# EAGLE design Enclosure 85x58 WS (EAGLE 9.6.2)
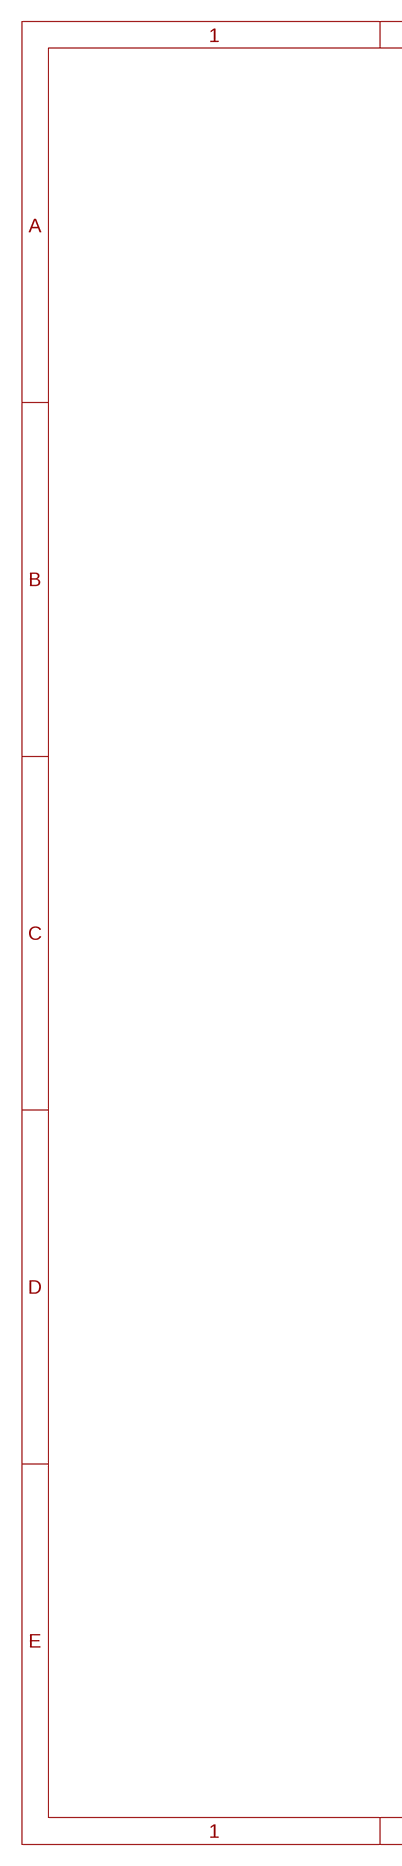
[diagram p0: schematic, sheet 1, part 1 of 2]
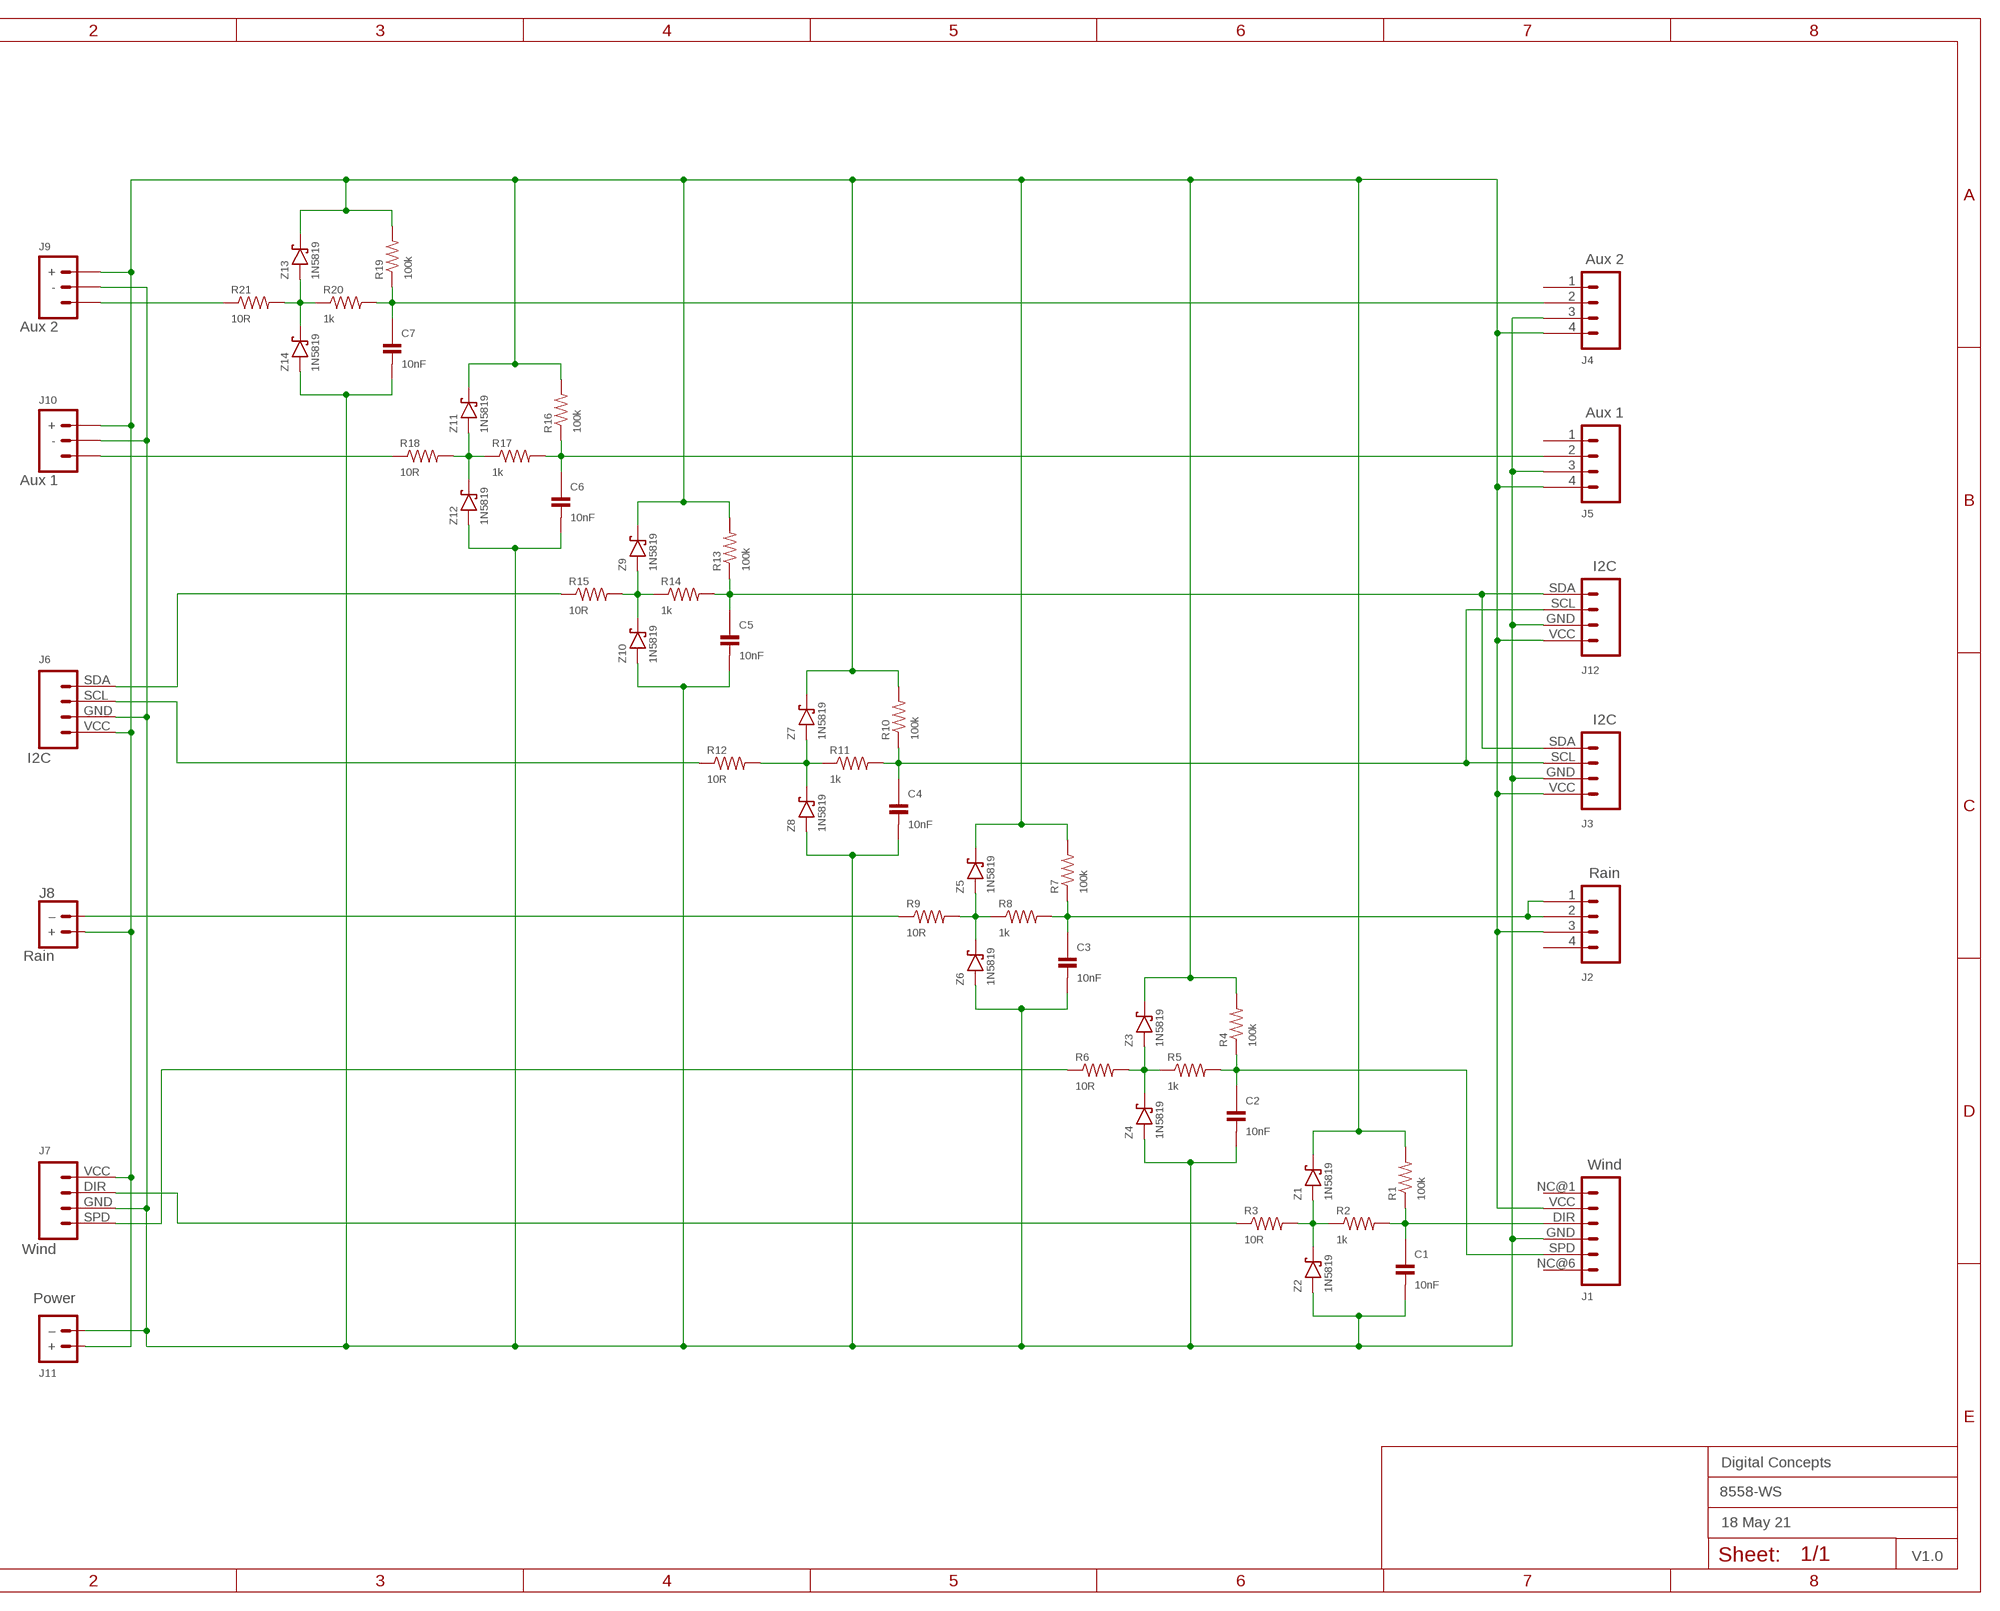
[diagram p1: schematic, sheet 1, part 2 of 2]
FRAME2 (A3L-LOC): DATE: 18 May 21; OWNER: Digital Concepts; TITLE: 8558-WS; VERSION: V1.0

## Parts
C1  10nF  CAPACITOR-0805-VIA-2  [C0805-VIA-2]
C2  10nF  CAPACITOR-0805-VIA-2  [C0805-VIA-2]
C3  10nF  CAPACITOR-0805-VIA-2  [C0805-VIA-2]
C4  10nF  CAPACITOR-0805-VIA-2  [C0805-VIA-2]
C5  10nF  CAPACITOR-0805-VIA-2  [C0805-VIA-2]
C6  10nF  CAPACITOR-0805-VIA-2  [C0805-VIA-2]
C7  10nF  CAPACITOR-0805-VIA-2  [C0805-VIA-2]
J1  Wind  RJ11-6P6C-VERTICAL-WIND  [RJ11-6-VERTICAL-WIND]
J2  Rain  RJ11-6P4C-VERTICAL  [RJ11-4-VERTICAL]
J3  I2C  RJ11-6P4C-VERTICAL-I2C  [RJ11-4-VERTICAL-I2C]
J4  Aux 2  RJ11-6P4C-VERTICAL  [RJ11-4-VERTICAL]
J5  Aux 1  RJ11-6P4C-VERTICAL  [RJ11-4-VERTICAL]
J6  I2C  JST-PH2.0-4-MALE-VERTICAL-I2C  [JST-PH2.0-4-VERTICAL-I2C]
J7  Wind  JST-PH2.0-4-MALE-VERTICAL-WIND  [JST-PH2.0-4-VERTICAL-WIND]
J8  Rain  JST-PH2.0-2-MALE-VERTICAL  [JST-PH2.0-2-VERTICAL=POWER]
J9  Aux 2  JST-PH2.0-3-MALE-VERTICAL  [JST-PH2.0-3-VERTICAL]
J10  Aux 1  JST-PH2.0-3-MALE-VERTICAL  [JST-PH2.0-3-VERTICAL]
J11  Power  JST-PH2.0-2-MALE-VERTICAL  [JST-PH2.0-2-VERTICAL=POWER]
J12  I2C  HEADER-1X4-I2C  [CONN_04-I2C]
R1  100k  RESISTORR0805  [R0805]
R2  1k  RESISTORR0805  [R0805]
R3  10R  RESISTOR-VIA-1  [R0805-VIA-1]
R4  100k  RESISTORR0805  [R0805]
R5  1k  RESISTORR0805  [R0805]
R6  10R  RESISTOR-VIA-1  [R0805-VIA-1]
R7  100k  RESISTORR0805  [R0805]
R8  1k  RESISTORR0805  [R0805]
R9  10R  RESISTOR-VIA-1  [R0805-VIA-1]
R10  100k  RESISTORR0805  [R0805]
R11  1k  RESISTORR0805  [R0805]
R12  10R  RESISTOR-VIA-1  [R0805-VIA-1]
R13  100k  RESISTORR0805  [R0805]
R14  1k  RESISTORR0805  [R0805]
R15  10R  RESISTOR-VIA-1  [R0805-VIA-1]
R16  100k  RESISTORR0805  [R0805]
R17  1k  RESISTORR0805  [R0805]
R18  10R  RESISTOR-VIA-1  [R0805-VIA-1]
R19  100k  RESISTORR0805  [R0805]
R20  1k  RESISTORR0805  [R0805]
R21  10R  RESISTOR-VIA-1  [R0805-VIA-1]
Z1  1N5819  DIODE-SCHOTTKY-1N5819  [SOD-123]
Z2  1N5819  DIODE-SCHOTTKY-1N5819-VIA-A  [SOD-123-VIA-A]
Z3  1N5819  DIODE-SCHOTTKY-1N5819  [SOD-123]
Z4  1N5819  DIODE-SCHOTTKY-1N5819-VIA-A  [SOD-123-VIA-A]
Z5  1N5819  DIODE-SCHOTTKY-1N5819  [SOD-123]
Z6  1N5819  DIODE-SCHOTTKY-1N5819-VIA-A  [SOD-123-VIA-A]
Z7  1N5819  DIODE-SCHOTTKY-1N5819  [SOD-123]
Z8  1N5819  DIODE-SCHOTTKY-1N5819-VIA-A  [SOD-123-VIA-A]
Z9  1N5819  DIODE-SCHOTTKY-1N5819  [SOD-123]
Z10  1N5819  DIODE-SCHOTTKY-1N5819-VIA-A  [SOD-123-VIA-A]
Z11  1N5819  DIODE-SCHOTTKY-1N5819  [SOD-123]
Z12  1N5819  DIODE-SCHOTTKY-1N5819-VIA-A  [SOD-123-VIA-A]
Z13  1N5819  DIODE-SCHOTTKY-1N5819  [SOD-123]
Z14  1N5819  DIODE-SCHOTTKY-1N5819-VIA-A  [SOD-123-VIA-A]

## Nets
GND: C1.2 C1.2@VIA C2.2 C2.2@VIA C3.2 C3.2@VIA C4.2 C4.2@VIA C5.2 C5.2@VIA C6.2 C6.2@VIA C7.2 C7.2@VIA J1.GND J3.GND J4.3 J5.3 J6.GND J7.GND J9.- J10.- J11.-(–) J12.GND Z2.A Z2.P$A(A) Z4.A Z4.P$A(A) Z6.A Z6.P$A(A) Z8.A Z8.P$A(A) Z10.A Z10.P$A(A) Z12.A Z12.P$A(A) Z14.A Z14.P$A(A)
N$1: R14.1 R15.2 Z9.A Z10.C
N$2: C2.1 J1.SPD R4.1 R5.2
N$3: C5.1 J3.SDA J12.SDA R13.1 R14.2
N$4: J7.DIR R3.1 R3.1@VIA
N$5: R11.1 R12.2 Z7.A Z8.C
N$6: C4.1 J3.SCL J12.SCL R10.1 R11.2
N$7: R8.1 R9.2 Z5.A Z6.C
N$8: J6.SDA R15.1 R15.1@VIA
N$9: J10.SIG R18.1 R18.1@VIA
N$10: J7.SPD R6.1 R6.1@VIA
N$11: J6.SCL R12.1 R12.1@VIA
N$12: J9.SIG R21.1 R21.1@VIA
N$13: R2.1 R3.2 Z1.A Z2.C
N$15: R17.1 R18.2 Z11.A Z12.C
N$20: C6.1 J5.2 R16.1 R17.2
N$22: R20.1 R21.2 Z13.A Z14.C
N$23: C7.1 J4.2 R19.1 R20.2
N$25: C3.1 J2.1 J2.2 R7.1 R8.2
N$27: C1.1 J1.DIR R1.1 R2.2
N$29: R5.1 R6.2 Z3.A Z4.C
N$32: J8.-(–) R9.1 R9.1@VIA
VCC: J1.VCC J2.3 J3.VCC J4.4 J5.4 J6.VCC J7.VCC J8.+ J9.+ J10.+ J11.+ J12.VCC R1.2 R4.2 R7.2 R10.2 R13.2 R16.2 R19.2 Z1.C Z3.C Z5.C Z7.C Z9.C Z11.C Z13.C
Unconnected: J1.NC@1 J1.NC@6 J2.4 J4.1 J5.1

## Library data of the parts
C1-C7 = digitalconcepts:CAPACITOR-0805-VIA-2: 0805 Capacitor with via on Pad 2
J1 = digitalconcepts:RJ11-6P6C-VERTICAL-WIND: RJ11-6P6C-Vertical PCB Socket
J2 J4 J5 = digitalconcepts:RJ11-6P4C-VERTICAL: RJ11-6P4C-Vertical PCB Socket
J3 = digitalconcepts:RJ11-6P4C-VERTICAL-I2C: RJ11-6P4C-Vertical PCB Socket
J6 = digitalconcepts:JST-PH2.0-4-MALE-VERTICAL-I2C: PH2.0 4P PCB Connector I2C
J7 = digitalconcepts:JST-PH2.0-4-MALE-VERTICAL-WIND: PH2.0 4P PCB Connector Davis Anemometer
J8 J11 = digitalconcepts:JST-PH2.0-2-MALE-VERTICAL: PH2.0 2P PCB Connector
J9 J10 = digitalconcepts:JST-PH2.0-3-MALE-VERTICAL: PH2.0 3P PCB Connector
J12 = digitalconcepts:HEADER-1X4-I2C: I2C Interface 1x4 Pin Header for I2C Interface
R1 R2 R4 R5 R7 R8 R10 R11 R13 R14 R16 R17 R19 R20 = digitalconcepts:RESISTOR: Resistor; SPICEPREFIX: R
R3 R6 R9 R12 R15 R18 R21 = digitalconcepts:RESISTOR-VIA-1: Resistor with via on Pad 1
Z1 Z3 Z5 Z7 Z9 Z11 Z13 = digitalconcepts:DIODE-SCHOTTKY-1N5819: 1N5819 Schottky Diode SOD-123
Z2 Z4 Z6 Z8 Z10 Z12 Z14 = digitalconcepts:DIODE-SCHOTTKY-1N5819-VIA-A: 1N5819 Schottky Diode SOD-123 with Cathode Via

## Board
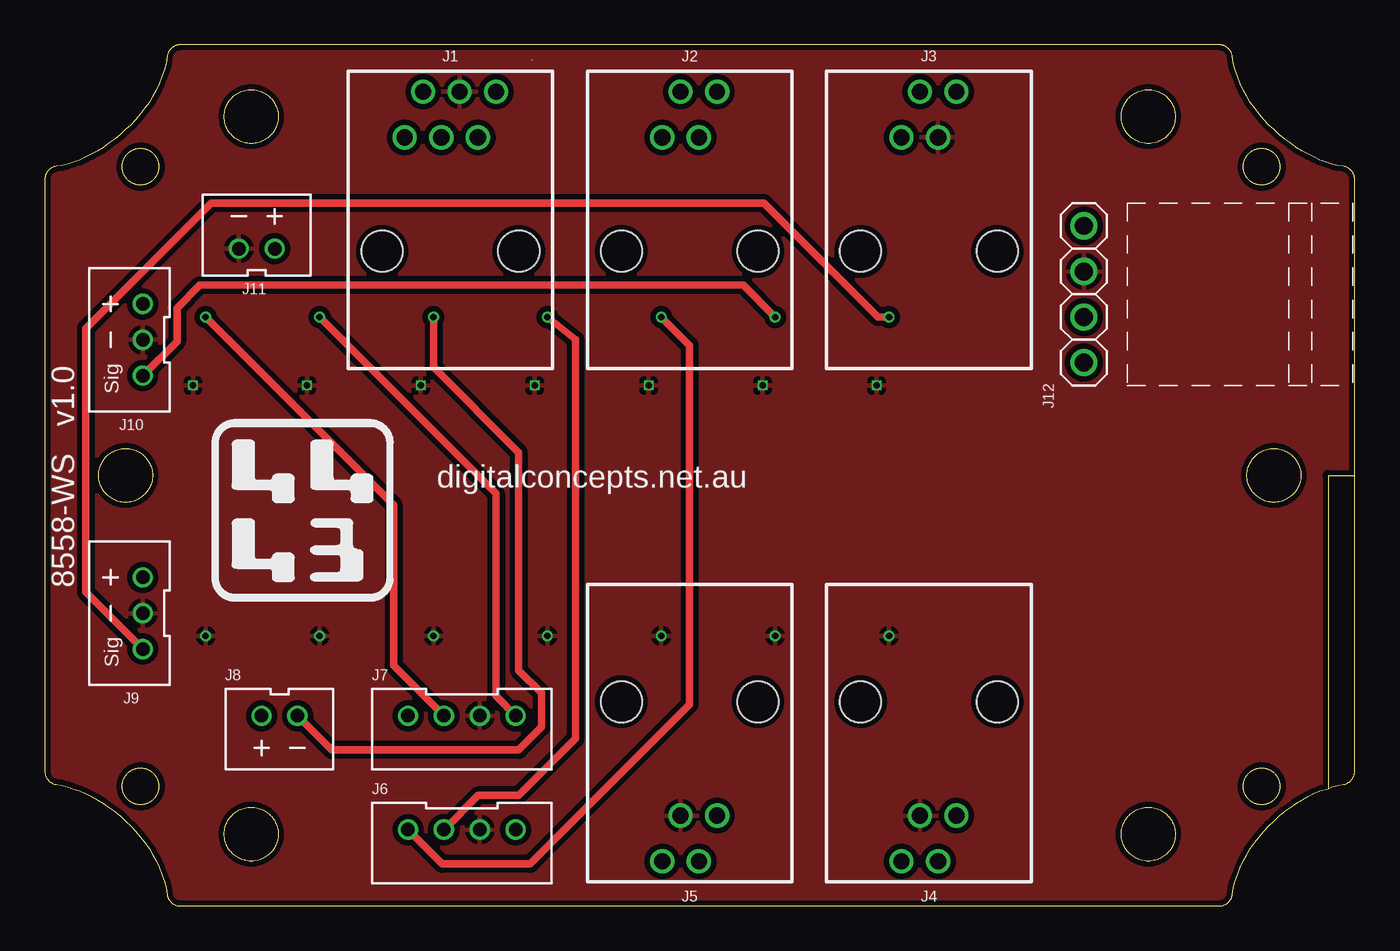
[diagram p2: board, top side]
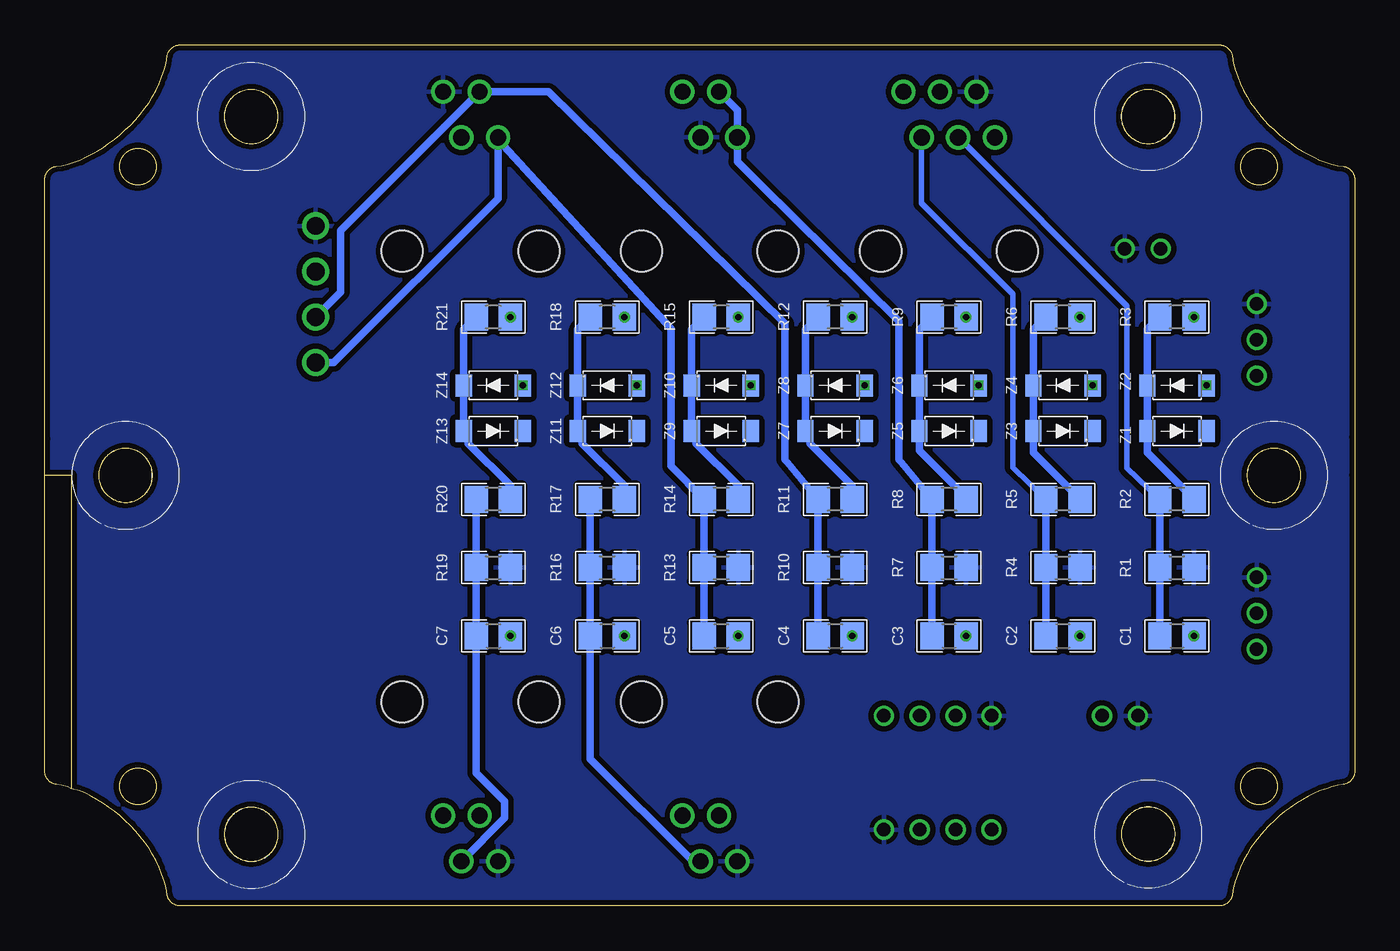
[diagram p3: board, bottom side, seen from below]

Size 73 x 48 mm. Coordinates in mm from the lower left corner, seen from the top.
Outline: 0,24 0,26.12 0,40.49 0,40.5 0,40.55 0,40.59 0.01,40.64 0.02,40.68 0.03,40.72 0.05,40.76 0.07,40.8 0.09,40.84 0.11,40.88 0.13,40.92 0.16,40.95 0.18,40.98 0.21,41.02 0.24,41.05 0.28,41.07 0.31,41.1 0.35,41.12 0.38,41.14 0.42,41.16 0.46,41.18 0.5,41.2 0.54,41.21 0.58,41.22 0.63,41.23 0.94,41.27 1.27,41.36 1.6,41.47 1.93,41.58 2.26,41.73 2.59,41.9 2.92,42.08 3.25,42.28 3.57,42.51 3.89,42.73 4.2,42.98 4.49,43.26 4.78,43.53 5.06,43.83 5.32,44.14 5.57,44.46 5.8,44.79 6.01,45.14 6.21,45.48 6.38,45.85 6.52,46.22 6.66,46.6 6.76,46.98 6.82,47.38 6.83,47.42 6.84,47.47 6.85,47.51 6.87,47.55 6.89,47.59 6.91,47.63 6.93,47.66 6.95,47.7 6.98,47.73 7.01,47.76 7.04,47.79 7.07,47.82 7.1,47.85 7.14,47.87 7.17,47.9 7.21,47.92 7.25,47.94 7.29,47.95 7.33,47.97 7.37,47.98 7.42,47.99 7.46,48 7.51,48 65.49,48 65.54,48 65.58,47.99 65.63,47.98 65.67,47.97 65.71,47.95 65.75,47.94 65.79,47.92 65.83,47.9 65.86,47.87 65.9,47.85 65.93,47.82 65.96,47.79 65.99,47.76 66.02,47.73 66.05,47.7 66.07,47.66 66.09,47.63 66.11,47.59 66.13,47.55 66.15,47.51 66.16,47.47 66.17,47.42 66.18,47.38 66.24,46.98 66.34,46.6 66.48,46.22 66.62,45.85 66.79,45.48 66.99,45.14 67.2,44.79 67.43,44.46 67.68,44.14 67.94,43.83 68.22,43.53 68.51,43.26 68.8,42.98 69.11,42.73 69.43,42.51 69.75,42.28 70.08,42.08 70.41,41.9 70.74,41.73 71.07,41.58 71.4,41.47 71.73,41.36 72.06,41.27 72.37,41.23 72.42,41.22 72.46,41.21 72.5,41.2 72.54,41.18 72.58,41.16 72.62,41.14 72.65,41.12 72.69,41.1 72.72,41.07 72.76,41.05 72.79,41.02 72.82,40.98 72.84,40.95 72.87,40.92 72.89,40.88 72.92,40.84 72.93,40.8 72.95,40.76 72.97,40.72 72.98,40.68 72.99,40.64 73,40.59 73,40.55 73,26.05 73,24
Outline: 0,24 0,7.45 0,7.41 0.01,7.36 0.02,7.32 0.03,7.28 0.05,7.24 0.07,7.19 0.09,7.16 0.11,7.12 0.13,7.08 0.16,7.05 0.18,7.02 0.21,6.98 0.24,6.95 0.28,6.93 0.31,6.9 0.35,6.88 0.38,6.86 0.42,6.84 0.46,6.82 0.5,6.8 0.54,6.79 0.58,6.78 0.63,6.77 0.94,6.72 1.27,6.64 1.47,6.57 1.93,6.41 2.26,6.27 2.59,6.1 2.92,5.92 3.25,5.72 3.57,5.49 3.89,5.27 4.2,5.01 4.49,4.74 4.78,4.47 5.06,4.17 5.32,3.86 5.57,3.54 5.8,3.21 6.01,2.86 6.21,2.52 6.38,2.15 6.52,1.78 6.66,1.4 6.76,1.02 6.82,0.62 6.83,0.58 6.84,0.53 6.85,0.49 6.87,0.45 6.89,0.41 6.91,0.37 6.93,0.34 6.95,0.3 6.98,0.27 7.01,0.24 7.04,0.21 7.07,0.18 7.1,0.15 7.14,0.13 7.17,0.1 7.21,0.08 7.25,0.06 7.29,0.05 7.33,0.03 7.37,0.02 7.42,0.01 7.46,0 7.51,0 65.49,0 65.54,0 65.58,0.01 65.62,0.02 65.67,0.03 65.71,0.05 65.75,0.06 65.79,0.08 65.82,0.1 65.86,0.13 65.9,0.15 65.93,0.18 65.96,0.21 65.99,0.24 66.02,0.27 66.05,0.3 66.07,0.34 66.09,0.37 66.11,0.41 66.13,0.45 66.14,0.49 66.16,0.53 66.17,0.58 66.18,0.62 66.24,1.02 66.34,1.4 66.48,1.78 66.62,2.15 66.79,2.52 66.99,2.86 67.2,3.21 67.43,3.54 67.68,3.86 67.94,4.17 68.22,4.47 68.51,4.74 68.8,5.01 69.11,5.27 69.43,5.49 69.75,5.72 70.08,5.92 70.41,6.1 70.74,6.27 71.07,6.41 71.53,6.53
Outline: 71.53,6.53 71.73,6.64 72.06,6.72 72.37,6.77 72.41,6.78 72.46,6.79 72.5,6.8 72.54,6.82 72.58,6.84 72.62,6.86 72.65,6.88 72.69,6.9 72.72,6.93 72.76,6.95 72.79,6.98 72.82,7.02 72.84,7.05 72.87,7.08 72.89,7.12 72.91,7.16 72.93,7.19 72.95,7.24 72.97,7.28 72.98,7.32 72.99,7.36 72.99,7.41 73,7.45 73,14.22 73,16.02 73,24
Outline: 0,24 0,24
Outline: 71.53,6.53 71.53,24 73,24
Outline: 5.97,23.7 5.95,23.6 5.92,23.51 5.88,23.42 5.84,23.33 5.8,23.24 5.74,23.16 5.69,23.08 5.63,23.01 5.56,22.94 5.49,22.87 5.42,22.81 5.34,22.76 5.26,22.7 5.17,22.66 5.08,22.62 4.99,22.58 4.9,22.55 4.8,22.53 4.7,22.51 4.6,22.5 4.4,22.5 4.3,22.51 4.2,22.53 4.1,22.55 4.01,22.58 3.92,22.62 3.83,22.66 3.74,22.7 3.66,22.76 3.58,22.81 3.51,22.87 3.44,22.94 3.37,23.01 3.31,23.08 3.26,23.16 3.2,23.24 3.16,23.33 3.12,23.42 3.08,23.51 3.05,23.6 3.03,23.7 3.01,23.8 3,23.9 3,24.1 3.01,24.2 3.03,24.3 3.05,24.4 3.08,24.49 3.12,24.58 3.16,24.67 3.2,24.76 3.26,24.84 3.31,24.92 3.37,24.99 3.51,25.13 3.58,25.19 3.66,25.24 3.74,25.3 3.83,25.34 3.92,25.38 4.01,25.42 4.1,25.45 4.2,25.47 4.3,25.49 4.4,25.5 4.6,25.5 4.7,25.49 4.8,25.47 4.9,25.45 4.99,25.42 5.08,25.38 5.17,25.34 5.26,25.3 5.34,25.24 5.42,25.19 5.49,25.13 5.63,24.99 5.69,24.92 5.74,24.84 5.8,24.76 5.84,24.67 5.88,24.58 5.92,24.49 5.95,24.4 5.97,24.3 5.99,24.2 6,24.1 6,23.9 5.99,23.8 5.97,23.7
Outline: 12.97,3.7 12.95,3.6 12.92,3.51 12.88,3.42 12.84,3.33 12.8,3.24 12.74,3.16 12.69,3.08 12.63,3.01 12.56,2.94 12.49,2.87 12.42,2.81 12.26,2.7 12.17,2.66 12.08,2.62 11.99,2.58 11.9,2.55 11.7,2.51 11.6,2.5 11.4,2.5 11.3,2.51 11.2,2.53 11.1,2.55 11.01,2.58 10.92,2.62 10.83,2.66 10.74,2.7 10.58,2.81 10.51,2.87 10.44,2.94 10.37,3.01 10.31,3.08 10.26,3.16 10.2,3.24 10.16,3.33 10.12,3.42 10.08,3.51 10.05,3.6 10.03,3.7 10.01,3.8 10,3.9 10,4.1 10.01,4.2 10.03,4.3 10.05,4.4 10.08,4.49 10.12,4.58 10.16,4.67 10.2,4.76 10.26,4.84 10.31,4.92 10.37,4.99 10.44,5.06 10.51,5.13 10.58,5.19 10.74,5.3 10.83,5.34 10.92,5.38 11.01,5.42 11.1,5.45 11.2,5.47 11.3,5.49 11.4,5.5 11.6,5.5 11.7,5.49 11.8,5.47 11.9,5.45 11.99,5.42 12.08,5.38 12.17,5.34 12.26,5.3 12.42,5.19 12.49,5.13 12.56,5.06 12.63,4.99 12.69,4.92 12.74,4.84 12.8,4.76 12.84,4.67 12.88,4.58 12.92,4.49 12.95,4.4 12.97,4.3 12.99,4.2 13,4.1 13,3.9 12.99,3.8 12.97,3.7
Outline: 12.97,43.7 12.95,43.6 12.92,43.51 12.88,43.42 12.84,43.33 12.8,43.24 12.74,43.16 12.69,43.08 12.63,43.01 12.49,42.87 12.42,42.81 12.34,42.76 12.26,42.7 12.17,42.66 12.08,42.62 11.99,42.58 11.9,42.55 11.8,42.53 11.7,42.51 11.6,42.5 11.4,42.5 11.3,42.51 11.2,42.53 11.1,42.55 11.01,42.58 10.83,42.66 10.74,42.7 10.66,42.76 10.58,42.81 10.51,42.87 10.44,42.94 10.37,43.01 10.31,43.08 10.26,43.16 10.2,43.24 10.16,43.33 10.12,43.42 10.08,43.51 10.05,43.6 10.03,43.7 10.01,43.8 10,43.9 10,44.1 10.01,44.2 10.03,44.3 10.05,44.4 10.08,44.49 10.12,44.58 10.16,44.67 10.2,44.76 10.26,44.84 10.31,44.92 10.37,44.99 10.44,45.06 10.51,45.13 10.58,45.19 10.66,45.24 10.74,45.3 10.83,45.34 10.92,45.38 11.01,45.42 11.1,45.45 11.2,45.47 11.3,45.49 11.4,45.5 11.6,45.5 11.7,45.49 11.8,45.47 11.9,45.45 11.99,45.42 12.08,45.38 12.17,45.34 12.26,45.3 12.42,45.19 12.49,45.13 12.56,45.06 12.63,44.99 12.69,44.92 12.74,44.84 12.8,44.76 12.84,44.67 12.88,44.58 12.92,44.49 12.95,44.4 12.97,44.3 12.99,44.2 13,44.1 13,43.9 12.99,43.8 12.97,43.7
Outline: 62.97,3.7 62.95,3.6 62.92,3.51 62.88,3.42 62.84,3.33 62.8,3.24 62.74,3.16 62.69,3.08 62.63,3.01 62.56,2.94 62.49,2.87 62.42,2.81 62.34,2.76 62.26,2.7 62.17,2.66 62.08,2.62 61.99,2.58 61.9,2.55 61.8,2.53 61.7,2.51 61.6,2.5 61.4,2.5 61.3,2.51 61.1,2.55 61.01,2.58 60.92,2.62 60.83,2.66 60.74,2.7 60.66,2.76 60.58,2.81 60.51,2.87 60.44,2.94 60.37,3.01 60.31,3.08 60.26,3.16 60.2,3.24 60.16,3.33 60.12,3.42 60.08,3.51 60.05,3.6 60.03,3.7 60.01,3.8 60,3.9 60,4.1 60.01,4.2 60.03,4.3 60.05,4.4 60.08,4.49 60.12,4.58 60.16,4.67 60.2,4.76 60.26,4.84 60.31,4.92 60.37,4.99 60.44,5.06 60.51,5.13 60.58,5.19 60.66,5.24 60.74,5.3 60.83,5.34 60.92,5.38 61.01,5.42 61.1,5.45 61.2,5.47 61.3,5.49 61.4,5.5 61.6,5.5 61.7,5.49 61.8,5.47 61.9,5.45 61.99,5.42 62.08,5.38 62.17,5.34 62.26,5.3 62.34,5.24 62.42,5.19 62.49,5.13 62.56,5.06 62.63,4.99 62.69,4.92 62.74,4.84 62.8,4.76 62.84,4.67 62.88,4.58 62.92,4.49 62.95,4.4 62.97,4.3 62.99,4.2 63,4.1 63,3.9 62.99,3.8 62.97,3.7
Outline: 62.97,43.7 62.95,43.6 62.92,43.51 62.88,43.42 62.84,43.33 62.8,43.24 62.74,43.16 62.69,43.08 62.63,43.01 62.56,42.94 62.49,42.87 62.42,42.81 62.34,42.76 62.26,42.7 62.17,42.66 62.08,42.62 61.99,42.58 61.9,42.55 61.7,42.51 61.6,42.5 61.4,42.5 61.3,42.51 61.1,42.55 61.01,42.58 60.92,42.62 60.83,42.66 60.74,42.7 60.66,42.76 60.58,42.81 60.51,42.87 60.37,43.01 60.31,43.08 60.26,43.16 60.2,43.24 60.16,43.33 60.12,43.42 60.08,43.51 60.05,43.6 60.03,43.7 60.01,43.8 60,43.9 60,44.1 60.01,44.2 60.05,44.4 60.08,44.49 60.12,44.58 60.16,44.67 60.2,44.76 60.26,44.84 60.31,44.92 60.37,44.99 60.44,45.06 60.51,45.13 60.58,45.19 60.66,45.24 60.74,45.3 60.83,45.34 60.92,45.38 61.01,45.42 61.1,45.45 61.2,45.47 61.3,45.49 61.4,45.5 61.6,45.5 61.7,45.49 61.8,45.47 61.9,45.45 61.99,45.42 62.08,45.38 62.17,45.34 62.26,45.3 62.34,45.24 62.42,45.19 62.49,45.13 62.56,45.06 62.63,44.99 62.69,44.92 62.74,44.84 62.8,44.76 62.84,44.67 62.88,44.58 62.92,44.49 62.95,44.4 62.99,44.2 63,44.1 63,43.9 62.99,43.8 62.97,43.7
Outline: 69.97,23.7 69.95,23.6 69.92,23.51 69.88,23.42 69.84,23.33 69.8,23.24 69.74,23.16 69.69,23.08 69.63,23.01 69.56,22.94 69.49,22.87 69.42,22.81 69.34,22.76 69.26,22.7 69.17,22.66 69.08,22.62 68.99,22.58 68.9,22.55 68.8,22.53 68.7,22.51 68.6,22.5 68.4,22.5 68.3,22.51 68.2,22.53 68.1,22.55 68.01,22.58 67.92,22.62 67.83,22.66 67.74,22.7 67.66,22.76 67.58,22.81 67.51,22.87 67.44,22.94 67.37,23.01 67.31,23.08 67.26,23.16 67.2,23.24 67.16,23.33 67.12,23.42 67.08,23.51 67.05,23.6 67.03,23.7 67.01,23.8 67,23.9 67,24.1 67.01,24.2 67.03,24.3 67.05,24.4 67.08,24.49 67.12,24.58 67.16,24.67 67.2,24.76 67.26,24.84 67.31,24.92 67.37,24.99 67.44,25.06 67.51,25.13 67.58,25.19 67.66,25.24 67.74,25.3 67.83,25.34 67.92,25.38 68.01,25.42 68.1,25.45 68.2,25.47 68.3,25.49 68.4,25.5 68.6,25.5 68.7,25.49 68.8,25.47 68.9,25.45 68.99,25.42 69.08,25.38 69.17,25.34 69.26,25.3 69.34,25.24 69.42,25.19 69.49,25.13 69.56,25.06 69.63,24.99 69.69,24.92 69.74,24.84 69.8,24.76 69.84,24.67 69.88,24.58 69.92,24.49 69.95,24.4 69.97,24.3 69.99,24.2 70,24.1 70,23.9 69.99,23.8 69.97,23.7
Outline: circle at 5.33,41.21 radius 1.02
Outline: circle at 67.82,41.21 radius 1.02
Outline: circle at 5.33,6.67 radius 1.02
Outline: circle at 67.82,6.67 radius 1.02
Copper layers (1*16): Top 0.035mm / dielectric 1.5mm / Bottom 0.035mm
Design rules "default *": minimum track width 6mil, minimum drill 0.35mm, track to track 6mil, track to pad 6mil, pad to pad 6mil, via to via 6mil, smd to smd 6mil, copper to edge 6mil, drill to drill 6mil, minimum pad ring 1mil, minimum via ring 8mil, stop-mask expansion 4mil, vias tented up to drill 0mil, thermal gap 10mil

### Footprints (pad centres in the part's own frame; a part is rotated, then mirrored left to right if it is on the bottom)
C0805-VIA-2 = smd 1.3 x 1.5: 1 -0.95,0; 2 0.95,0 | drill 0.35 pad 0.61: 2@VIA 0.95,0
RJ11-6-VERTICAL-WIND = drill 0.9: DIR -0.51,4.3; GND 0.51,6.84; NC@1 -2.55,4.3; NC@6 2.55,6.84; SPD 1.53,4.3; VCC -1.53,6.84 | hole 2.3: -3.81,-2.05; 3.81,-2.05
RJ11-4-VERTICAL = drill 0.9: 1 -1.53,4.3; 2 -0.51,6.84; 3 0.51,4.3; 4 1.53,6.84 | hole 2.3: -3.81,-2.05; 3.81,-2.05
RJ11-4-VERTICAL-I2C = drill 0.9: GND 0.51,4.3; SCL -0.51,6.84; SDA -1.53,4.3; VCC 1.53,6.84 | hole 2.3: -3.81,-2.05; 3.81,-2.05
JST-PH2.0-4-VERTICAL-I2C = drill 0.75: GND 1,0; SCL -1,0; SDA -3,0; VCC 3,0
JST-PH2.0-4-VERTICAL-WIND = drill 0.75: DIR -1,0; GND 1,0; SPD 3,0; VCC -3,0
JST-PH2.0-2-VERTICAL=POWER = drill 0.75: + -1,0; - 1,0
JST-PH2.0-3-VERTICAL = drill 0.75: + -2,0; - 0,0; SIG 2,0
CONN_04-I2C = drill 1 pad 1.524: GND 5.08,0; SCL 2.54,0; SDA 0,0; VCC 7.62,0
R0805 = smd 1.3 x 1.5: 1 -0.95,0; 2 0.95,0
R0805-VIA-1 = smd 1.3 x 1.5: 1 -0.95,0; 2 0.95,0 | drill 0.35 pad 0.61: 1@VIA -0.95,0
SOD-123 = smd 0.91 x 1.22: A -1.65,0; C 1.65,0
SOD-123-VIA-A = smd 0.91 x 1.22: A -1.65,0; C 1.65,0 | drill 0.35 square: P$A -1.65,0

### Placement (x,y rotation side)
C1  9.9,15.05 0 bottom
C2  16.25,15.05 0 bottom
C3  22.6,15.05 0 bottom
C4  28.95,15.05 0 bottom
C5  35.3,15.05 0 bottom
C6  41.65,15.05 0 bottom
C7  48,15.05 0 bottom
J1  22.6,38.54 0 top
J2  35.94,38.54 0 top
J3  49.27,38.54 0 top
J4  49.27,9.33 180 top
J5  35.94,9.33 180 top
J6  23.24,4.25 0 top
J7  23.24,10.6 0 top
J8  13.08,10.6 0 top
J9  5.46,16.32 270 top
J10  5.46,31.56 270 top
J11  11.81,36.64 180 top
J12  57.91,30.29 90 top
R1  9.9,18.86 0 bottom
R2  9.9,22.67 180 bottom
R3  9.9,32.83 180 bottom
R4  16.25,18.86 0 bottom
R5  16.25,22.67 180 bottom
R6  16.25,32.83 180 bottom
R7  22.6,18.86 0 bottom
R8  22.6,22.67 180 bottom
R9  22.6,32.83 180 bottom
R10  28.95,18.86 0 bottom
R11  28.95,22.67 180 bottom
R12  28.95,32.83 180 bottom
R13  35.3,18.86 0 bottom
R14  35.3,22.67 180 bottom
R15  35.3,32.83 180 bottom
R16  41.65,18.86 0 bottom
R17  41.65,22.67 180 bottom
R18  41.65,32.83 180 bottom
R19  48,18.86 0 bottom
R20  48,22.67 180 bottom
R21  48,32.83 180 bottom
Z1  9.9,26.48 0 bottom
Z2  9.9,29.02 180 bottom
Z3  16.25,26.48 0 bottom
Z4  16.25,29.02 180 bottom
Z5  22.6,26.48 0 bottom
Z6  22.6,29.02 180 bottom
Z7  28.95,26.48 0 bottom
Z8  28.95,29.02 180 bottom
Z9  35.3,26.48 0 bottom
Z10  35.3,29.02 180 bottom
Z11  41.65,26.48 0 bottom
Z12  41.65,29.02 180 bottom
Z13  48,26.48 0 bottom
Z14  48,29.02 180 bottom

### Tracks (layer width: path | path; a pad name or v marks a point on that pad's centre or on a via)
GND
  pour Top (isolate 0.305): -1.96,49.87 -1.96,-2.03 75.04,-2.03 75.04,49.87
N$1
  Bottom 0.406: R15.2 36.95,32.13 Z10.C Z9.A 36.71,26.23 36.71,25.78 34.35,23.43 R14.1
N$2
  Bottom 0.305: R5.2 19.05,24.43 19.05,34.1 24.13,39.18 J1.SPD
  Bottom 0.406: R5.2 R4.1 C2.1
N$3
  Bottom 0.406: C5.1 R13.1 R14.2 38.1,24.51 38.1,32.19 47.74,42.72 J3.SDA 47.74,39.44 56.89,30.29 J12.SDA
N$4
  Top 0.406: R3.1@VIA 19.43,22.35 19.43,13.41 J7.DIR
N$5
  Bottom 0.406: R12.2 30.6,32.13 Z8.C Z7.A 30.36,26.23 30.36,25.78 28,23.43 R11.1
N$6
  Bottom 0.406: C4.1 R10.1 R11.2 31.75,24.89 31.75,32.46 44.94,45.38 J3.SCL 56.51,37.63 56.51,34.22 J12.SCL
N$7
  Bottom 0.406: R9.2 24.25,32.13 Z6.C Z5.A 24.25,25.4 21.65,22.8 R8.1
N$8
  Top 0.406: J6.SDA 22.14,2.35 27.05,2.35 35.94,11.24 35.94,31.24 R15.1@VIA
N$9
  Top 0.406: R18.1@VIA 38.93,34.61 8.63,34.61 7.36,33.34 7.36,31.46 J10.SIG
N$10
  Top 0.406: R6.1@VIA 25.14,22.99 25.14,11.7 J7.SPD
N$11
  Top 0.406: J6.SCL 24.14,6.16 26.41,6.16 29.59,9.33 29.59,31.56 R12.1@VIA
N$12
  Top 0.406: R21.1@VIA 46.42,32.83 40.07,39.18 9.27,39.18 2.28,32.19 2.28,17.49 J9.SIG
N$13
  Bottom 0.406: R3.2 10.85,32.82 11.55,32.16 Z2.C Z1.A 11.55,25.27 9.85,23.56 R2.1
N$15
  Bottom 0.406: R18.2 43.3,32.13 Z12.C Z11.A 43.06,26.23 43.06,25.78 40.7,23.43 R17.1
N$20
  Bottom 0.406: R17.2 R16.1 C6.1 42.6,8.21 36.89,2.49 J5.2
N$22
  Bottom 0.406: R21.2 49.65,32.13 Z14.C Z13.A 49.41,26.23 49.41,25.78 47.05,23.43 R20.1
N$23
  Bottom 0.406: R20.2 R19.1 C7.1 48.95,7.43 47.37,5.84 47.37,4.91 J4.2
N$25
  Bottom 0.406: C3.1 R7.1 R8.2 25.4,24.89 25.4,32.62 33.15,40.23 34.41,41.49 J2.1 34.41,44.26 34.41,44.36 J2.2
N$27
  Bottom 0.305: R2.2 12.7,24.4 12.7,33.45 J1.DIR
  Bottom 0.406: C1.1 R1.1 R2.2
N$29
  Bottom 0.406: R5.1 16.2,23.56 17.9,25.27 Z3.A Z4.C 17.9,32.13 R6.2
N$32
  Top 0.406: R9.1@VIA 21.65,30.03 26.41,25.27 26.41,13.14 27.68,11.87 27.68,9.97 26.41,8.7 15.98,8.7 J8.-
VCC
  pour Bottom (isolate 0.305, rank 2): -0.96,48.87 -0.96,-1.03 74.04,-1.03 74.04,48.87

### Text on the board
tPlace: 8558-WS v1.0 | digitalconcepts.net.au